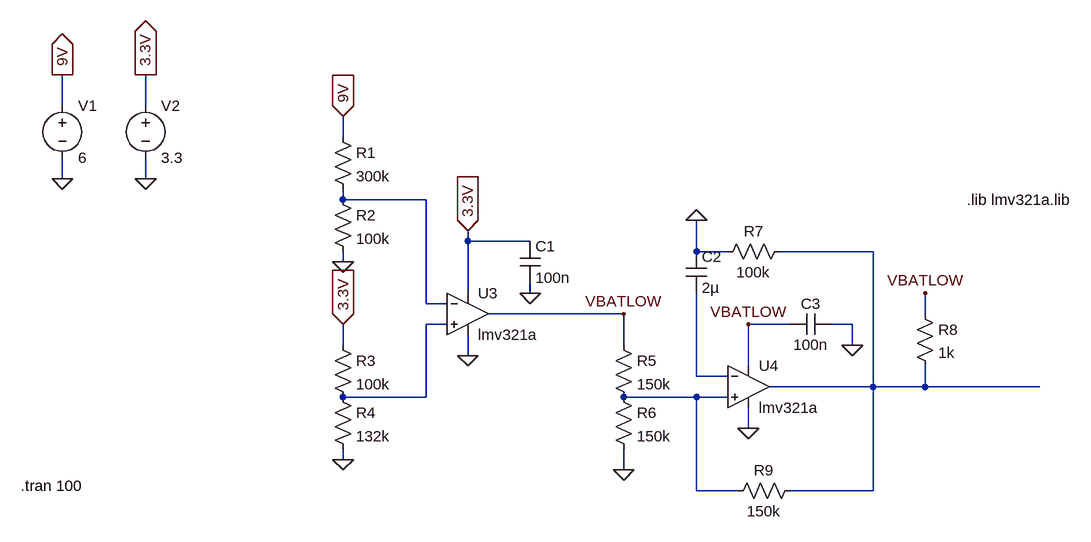
[diagram p0: schematic Low Battery Indicator.asc]
Low Battery Indicator.asc, the LTspice schematic file:
Version 4.1
SHEET 1 1108 680
WIRE -480 32 -480 -16
WIRE -352 32 -352 -16
WIRE -48 80 -48 48
WIRE -480 144 -480 112
WIRE -352 144 -352 112
WIRE -48 176 -48 160
WIRE 80 176 -48 176
WIRE 144 240 144 224
WIRE 240 240 144 240
WIRE 496 256 496 208
WIRE 544 256 496 256
WIRE 768 256 624 256
WIRE -48 272 -48 256
WIRE 144 320 144 240
WIRE 240 320 240 304
WIRE 80 336 80 176
WIRE 112 336 80 336
WIRE 384 352 176 352
WIRE 848 352 848 320
WIRE 112 368 80 368
WIRE 640 368 576 368
WIRE 736 368 704 368
WIRE -48 400 -48 368
WIRE 384 400 384 352
WIRE 736 400 736 368
WIRE 144 416 144 384
WIRE 576 432 576 368
WIRE 496 448 496 320
WIRE 544 448 496 448
WIRE 768 464 768 256
WIRE 768 464 608 464
WIRE 848 464 848 432
WIRE 848 464 768 464
WIRE 1024 464 848 464
WIRE 80 480 80 368
WIRE 80 480 -48 480
WIRE 496 480 384 480
WIRE 544 480 496 480
WIRE 576 528 576 496
WIRE -48 576 -48 560
WIRE 384 592 384 560
WIRE 496 624 496 480
WIRE 560 624 496 624
WIRE 768 624 768 464
WIRE 768 624 640 624
FLAG -480 -16 9V
IOPIN -480 -16 Out
FLAG -352 -16 3.3V
IOPIN -352 -16 Out
FLAG -480 144 0
FLAG -352 144 0
FLAG 144 224 3.3V
IOPIN 144 224 In
FLAG 240 320 0
FLAG -48 48 9V
IOPIN -48 48 In
FLAG -48 272 0
FLAG -48 368 3.3V
IOPIN -48 368 In
FLAG -48 576 0
FLAG 144 416 0
FLAG 384 352 VBATLOW
FLAG 384 592 0
FLAG 496 208 0
FLAG 576 368 VBATLOW
FLAG 736 400 0
FLAG 576 528 0
FLAG 848 320 VBATLOW
SYMBOL voltage -480 16 R0
WINDOW 123 0 0 Left 0
WINDOW 39 0 0 Left 0
SYMATTR InstName V1
SYMATTR Value 6
SYMBOL voltage -352 16 R0
WINDOW 123 0 0 Left 0
WINDOW 39 0 0 Left 0
SYMATTR InstName V2
SYMATTR Value 3.3
SYMBOL cap 224 240 R0
SYMATTR InstName C1
SYMATTR Value 100n
SYMBOL res -64 64 R0
SYMATTR InstName R1
SYMATTR Value 300k
SYMBOL res -64 160 R0
SYMATTR InstName R2
SYMATTR Value 100k
SYMBOL res -64 384 R0
SYMATTR InstName R3
SYMATTR Value 100k
SYMBOL res -64 464 R0
SYMATTR InstName R4
SYMATTR Value 132k
SYMBOL res 368 384 R0
SYMATTR InstName R5
SYMATTR Value 150k
SYMBOL res 368 464 R0
SYMATTR InstName R6
SYMATTR Value 150k
SYMBOL cap 480 256 R0
SYMATTR InstName C2
SYMATTR Value 2µ
SYMBOL res 640 240 R90
WINDOW 0 0 56 VBottom 2
WINDOW 3 32 56 VTop 2
SYMATTR InstName R7
SYMATTR Value 100k
SYMBOL cap 704 352 R90
WINDOW 0 0 32 VBottom 2
WINDOW 3 32 32 VTop 2
SYMATTR InstName C3
SYMATTR Value 100n
SYMBOL res 832 336 R0
SYMATTR InstName R8
SYMATTR Value 1k
SYMBOL res 656 608 R90
WINDOW 0 0 56 VBottom 2
WINDOW 3 32 56 VTop 2
SYMATTR InstName R9
SYMATTR Value 150k
SYMBOL OpAmps\\opamp2 144 288 R0
SYMATTR InstName U3
SYMATTR Value lmv321a
SYMBOL OpAmps\\opamp2 576 400 R0
SYMATTR InstName U4
SYMATTR Value lmv321a
TEXT -544 616 Left 2 !.tran 100
TEXT 912 176 Left 2 !.lib lmv321a.lib

The netlist it stands for:
* Low Battery Indicator.asc
V1 9V 0 6
V2 3.3V 0 3.3
C1 3.3V 0 100n
R1 9V N001 300k
R2 N001 0 100k
R3 3.3V N003 100k
R4 N003 0 132k
R5 VBATLOW N005 150k
R6 N005 0 150k
C2 0 N004 2µ
R7 N002 0 100k
C3 0 VBATLOW 100n
R8 VBATLOW N002 1k
R9 N002 N005 150k
X§U3 N003 N001 3.3V 0 VBATLOW lmv321a  ; pins In+ In- V+ V- OUT
X§U4 N005 N004 VBATLOW 0 N002 lmv321a  ; pins In+ In- V+ V- OUT
.tran 100
.lib lmv321a.lib
.backanno
.end